# Altium schematic sheet Power over Ethernet.SchDoc
size A4; SheetNumber: 2; SheetTotal: 8
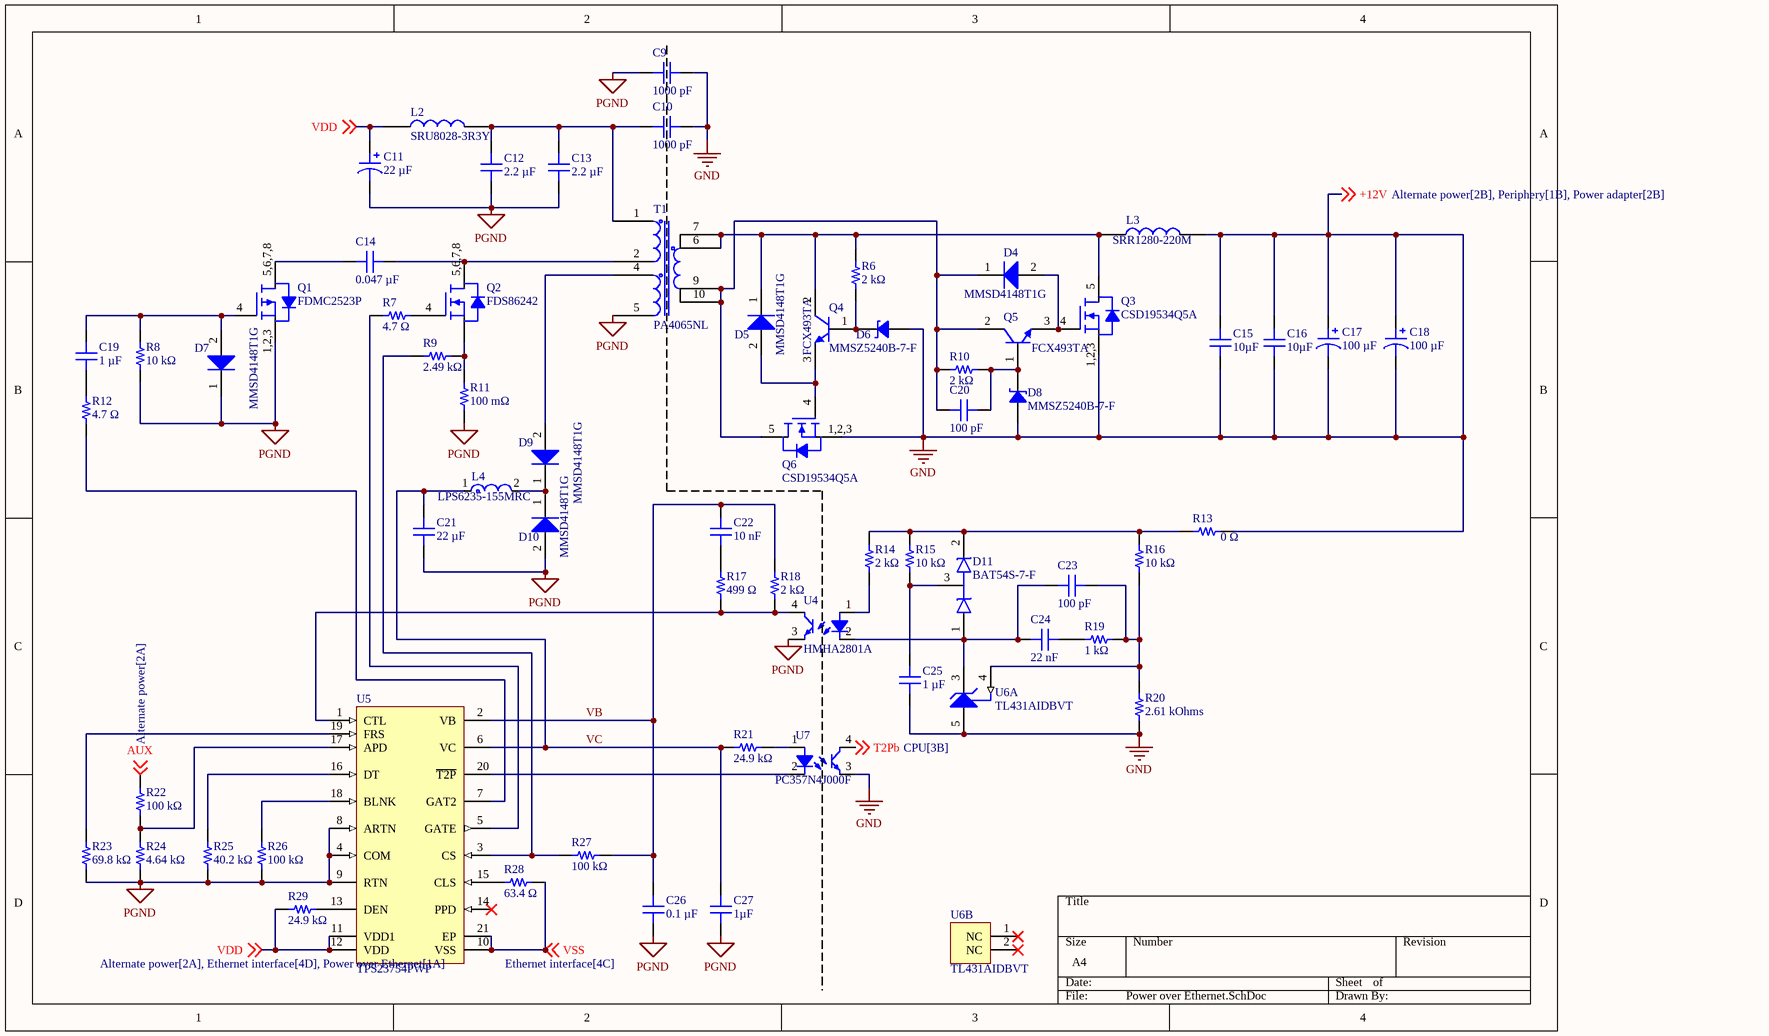
[diagram p0: Power over Ethernet.SchDoc]

## Parts
C9  1000 pF  [CAP 1210_3225 - 1MM]
C10  1000 pF  [CAP 1210_3225 - 1MM]
C11  22 µF  [CAP ALSMD 6.6MM H8.0MM]
C12  2.2 µF  [CAP 1210_3225 - 1MM]
C13  2.2 µF  [CAP 1210_3225 - 1MM]
C14  0.047 µF  [CAP 1206_3216 - 0.8MM]
C15  10µF  [CAP 1210_3225 - 2.8MM]
C16  10µF  [CAP 1210_3225 - 2.8MM]
C17  100 µF  [CAP ALSMD 8.3MM H10.5MM]
C18  100 µF  [CAP ALSMD POLY 8.3MM H9.0MM]
C19  1 µF  [CAP 0805_2012]
C20  100 pF  [CAP 0603_1608]
C21  22 µF  [CAP 1210_3225 - 1MM]
C22  Capacitance: 10 nF  [CAP 0603_1608]  (hidden comment: 10000 pF)
C23  100 pF  [CAP 0603_1608]
C24  Capacitance: 22 nF  [CAP 0603_1608]  (hidden comment: 0.022 µF)
C25  1 µF  [CAP 0805_2012]
C26  0.1 µF  [CAP 0603_1608]
C27  1µF  [CAP 0805_2012]
D4  MMSD4148T1G  [ONSC-SOD-123-2-425-04_V]
D5  MMSD4148T1G  [ONSC-SOD-123-2-425-04_V]
D6  MMSZ5240B-7-F  [SOD-123]
D7  MMSD4148T1G  [ONSC-SOD-123-2-425-04_V]
D8  MMSZ5240B-7-F  [SOD-123]
D9  MMSD4148T1G  [ONSC-SOD-123-2-425-04_V]
D10  MMSD4148T1G  [ONSC-SOD-123-2-425-04_V]
D11  BAT54S-7-F  [SOT96P240X115-3N]
L2  SRU8028-3R3Y  [SRU8028]
L3  SRR1280-220M  [SRR1280220M]
L4  LPS6235-155MRC  [FP-LPS6235-MFG]
Q1  FDMC2523P  [FDMC_2523P_ONS]
Q2  FDS86242  [SOIC127P600X175-8N]
Q3  CSD19534Q5A  [CSD19534Q5A]
Q4  FCX493TA  [FCX493TA_DIO]
Q5  FCX493TA  [FCX493TA_DIO]
Q6  CSD19534Q5A  [CSD19534Q5A]
R6  2 kΩ  [RES 1206_3216]
R7  4.7 Ω  [RES 0603_1608]
R8  10 kΩ  [RES 0603_1608]
R9  2.49 kΩ  [RES 0603_1608]
R10  2 kΩ  [RES 1206_3216]
R11  100 mΩ  [RES 1210_3225]
R12  4.7 Ω  [RES 0603_1608]
R13  0 Ω  [RES 0603_1608]
R14  2 kΩ  [RES 0603_1608]
R15  10 kΩ  [RES 0603_1608]
R16  10 kΩ  [RES 0603_1608]
R17  499 Ω  [RES 0603_1608]
R18  2 kΩ  [RES 0603_1608]
R19  1 kΩ  [RES 0603_1608]
R20  2.61 kOhms  [RES 0603_1608]
R21  24.9 kΩ  [RES 0603_1608]
R22  100 kΩ  [RES 0603_1608]
R23  69.8 kΩ  [RES 0603_1608]
R24  4.64 kΩ  [YAGEO RES 0603_1608]
R25  40.2 kΩ  [YAGEO RES 0603_1608]
R26  100 kΩ  [RES 0603_1608]
R27  100 kΩ  [RES 0603_1608]
R28  63.4 Ω  [KOA RES RK73 RN73 0603_1608]
R29  24.9 kΩ  [RES 0603_1608]
T1  PA4065NL  [PA4065NL]
U4  HMHA2801A  [SOIC127P680X239-4N]
U5  TPS23754PWP  [PWP0020D_M]
U6  TL431AIDBVT  [DBV0005A_N]  (parts A,B of 2)
U7  PC357N4J000F  [SOP254P675X300-4N]

## Nets
GND: C9.1 C10.1 C15.1 C15.2 C16.1 C16.2 C17.1 C17.2 C18.1 C18.2 C25.1 D6.1 D8.1 L3.2 Q3.1,2,3(S) Q6.1,2,3(S) R13.2 R20.1 U6.5(ANODE) U7.3 ; off-sheet +12V  [also labelled +12V]
PGND: C9.2 C11.2 C12.1 C13.1 C21.1 C26.1 C27.2 D7.1(K) D10.2(A) Q1.1,2,3(S) R8.1 R11.1 R23.1 R24.1 R25.1 R26.1 T1.5 U4.3 U5.4(COM) U5.8(ARTN) U5.9(RTN)
AUX: R22.2 ; off-sheet AUX
T2Pb: U7.4 ; off-sheet T2Pb
VB: C22.1 C26.2 R18.1 R27.2 U5.2(VB)
VC: C21.2 C27.1 L4.1 R21.1 U5.6(VC)
VDD: C11.1 L2.1 R29.1 U5.11(VDD1) U5.12(VDD) ; off-sheet VDD
VSS: R28.1 U5.10(VSS) U5.21(EP) ; off-sheet VSS
NetC10_2: C10.2 C12.2 C13.2 L2.2 T1.1
NetC14_1: C14.1 Q1.5,6,7,8(D)
NetC14_2: C14.2 Q2.5,6,7,8(D) T1.2
NetC19_1: C19.1 R12.2
NetC19_2: C19.2 D7.2(A) Q1.4(G) R8.2
NetC20_1: C20.1 D4.1(K) Q5.2(C) Q6.5(D) R10.2 T1.9 T1.10
NetC20_2: C20.2 D8.2 Q5.1(B) R10.1
NetC22_2: C22.2 R17.1
NetC23_1: C23.1 C24.1 D11.1(A) U4.2 U6.3(CATHODE)
NetC23_2: C23.2 R16.1 R19.2 R20.2 U6.4(REF)
NetC24_2: C24.2 R19.1
NetC25_2: C25.2 D11.3(A/K) R15.1
NetD4_2: D4.2(A) Q3.4(G) Q5.3(E)
NetD5_1: D5.1(K) L3.1 Q3.5(D) Q4.2(C) R6.2 T1.6 T1.7
NetD5_2: D5.2(A) Q4.3(E) Q6.4(G)
NetD6_2: D6.2 Q4.1(B) R6.1
NetD9_1: D9.1(K) D10.1(K) L4.2
NetD9_2: D9.2(A) T1.4
NetD11_2: D11.2(K) R13.1 R14.1 R15.2 R16.2
NetQ2_1,2,3: Q2.1,2,3(S) R9.2 R11.2
NetQ2_4: Q2.4(G) R7.2
NetR7_1: R7.1 U5.5(GATE)
NetR9_1: R9.1 R27.1 U5.3(CS)
NetR12_1: R12.1 U5.7(GAT2)
NetR14_2: R14.2 U4.1
NetR17_2: R17.2 R18.2 U4.4 U5.1(CTL)
NetR21_2: R21.2 U7.1
NetR22_1: R22.1 R24.2 U5.17(APD)
NetR23_2: R23.2 U5.19(FRS)
NetR25_2: R25.2 U5.16(DT)
NetR26_2: R26.2 U5.18(BLNK)
NetR28_2: R28.2 U5.15(CLS)
NetR29_2: R29.2 U5.13(DEN)
NetU5_20: U5.20(~{T2P}) U7.2

Not connected (* = marked no-connect by the designer): U5 14(PPD)*; U6 1(NC)* 2(NC)*

## Library data of the parts
C9 C10 = KGM32LCG3D102JU: CAP CER 1000PF 2KV C0G/NP0 1210; manufacturer: KYOCERA AVX; Temperature Coefficient: C0G, NP0; Tolerance: ±5%; Voltage - Rated: 2000V (2kV); Part Number: KGM32LCG3D102JU; Value: 1000 pF; Applications: General Purpose; Capacitance: 1000 pF; componentlink1description: Datasheet; componentlink1url: https://datasheets.kyocera-avx.com/HVKGM.pdf; componentlink2description: DigiKey Link; componentlink2url: https://www.digikey.com/en/products/detail/kyocera-avx/KGM32LCG3D102JU/11249117; Device Package: 1210 (3225 Metric); Features: High Voltage; lastupdated: 4.06.2024 19:20:42; Lifecycle Status: Active; Minimum Order: 1; Mounting Type: Surface Mount, MLCC; Operating Temperature: -55°C ~ 125°C; Package / Case: 1210 (3225 Metric); packaging: TapeAndReel; partid: 58470; price: 0.32; series: KGM - HV; Size / Dimension: 0.130" L x 0.098" W (3.30mm x 2.50mm); Supplier 1: DigiKey; Supplier Part Number 1: 478-KGM32LCG3D102JUCT-ND; Thickness (Max): 0.110" (2.80mm)
C11 = EEE-FK1J220XP: CAP ALUM 22UF 20% 63V SMD; manufacturer: Panasonic Electronic Components; Impedance: 1.2 Ohms; Lifetime @ Temp.: 2000 Hrs @ 105°C; Polarization: Polar; Ripple Current @ High Frequency: 120 mA @ 100 kHz; Ripple Current @ Low Frequency: 90 mA @ 120 Hz; Surface Mount Land Size: 0.260" L x 0.260" W (6.60mm x 6.60mm); Part Number: EEE-FK1J220XP; Applications: Automotive; Capacitance: 22 µF; componentlink2description: DigiKey Link; componentlink2url: https://www.digikey.com/en/products/detail/panasonic-electronic-components/EEE-FK1J220XP/765990; Device Package: Radial, Can - SMD; Height - Seated (Max): 0.315" (8.00mm); lastupdated: 3.06.2024 20:16:28; Lifecycle Status: Active; Minimum Order: 1; Mounting Type: Surface Mount; Operating Temperature: -55°C ~ 105°C; Package / Case: Radial, Can - SMD; packaging: TapeAndReel; partid: 27801; Part Status: Active; price: 0.14; Ratings: AEC-Q200; series: FK; Size / Dimension: 0.248" Dia (6.30mm); Tolerance: ±20%; value: 22 µF; Voltage - Rated: 63 V; Supplier 1: DigiKey; Supplier Part Number 1: PCE3821CT-ND
C12 C13 = CL32B225KCJSNNE: CAP CER 2.2UF 100V X7R 1210; manufacturer: Samsung Electro-Mechanics; Tolerance: ±10%; Part Number: CL32B225KCJSNNE; Value: 2.2 µF; Applications: General Purpose; Capacitance: 2.2 µF; componentlink1description: Datasheet; componentlink1url: http://www.samsungsem.com/kr/support/product-search/mlcc/CL32B225KCJSNNE .jsp; componentlink2description: DigiKey Link; componentlink2url: https://www.digikey.com/en/products/detail/samsung-electro-mechanics/CL32B225KCJSNNE/3889020; Device Package: 1210 (3225 Metric); Features: Soft Termination; lastupdated: 4.06.2024 19:20:59; Lifecycle Status: Active; Minimum Order: 1; Mounting Type: Surface Mount, MLCC; Operating Temperature: -55°C ~ 125°C; Package / Case: 1210 (3225 Metric); packaging: TapeAndReel; partid: 24106; Part Status: Active; price: 0.09; series: CL; Size / Dimension: 0.126" L x 0.098" W (3.20mm x 2.50mm); Supplier 1: DigiKey; Supplier Part Number 1: 1276-3362-1-ND; Temperature Coefficient: X7R; Thickness (Max): 0.106" (2.70mm); Voltage - Rated: 100V
C14 = C3216X7R2E473K160AA: CAP CER 0.047UF 250V X7R 1206; manufacturer: TDK Corporation; Tolerance: ±10%; Part Number: C3216X7R2E473K160AA; Capacitance: 0.047 µF; Applications: General Purpose; componentlink1description: Datasheet; componentlink1url: https://product.tdk.com/info/en/catalog/datasheets/mlcc_commercial_midvoltage_en.pdf?ref_disty=digikey; componentlink2description: DigiKey Link; componentlink2url: https://www.digikey.com/en/products/detail/tdk-corporation/C3216X7R2E473K160AA/789680; Device Package: 1206 (3216 Metric); lastupdated: 4.06.2024 19:10:39; Lifecycle Status: Active; Minimum Order: 1; Mounting Type: Surface Mount, MLCC; Operating Temperature: -55°C ~ 125°C; Package / Case: 1206 (3216 Metric); packaging: TapeAndReel; partid: 20477; Part Status: Active; price: 0.05; series: C; Size / Dimension: 0.126" L x 0.063" W (3.20mm x 1.60mm); Supplier 1: DigiKey; Supplier Part Number 1: 445-2286-1-ND; Temperature Coefficient: X7R; Thickness (Max): 0.071" (1.80mm); value: 0.047 µF; Voltage - Rated: 250V
C15 C16 = 12103C106K4T2A: CAP CER 10UF 25V X7R 1210; manufacturer: AVX Corporation; Tolerance: ±10%; Part Number: 12103C106K4T2A; Value: 10µF; Applications: Automotive; Capacitance: 10µF; componentlink1description: Datasheet; componentlink1url: http://datasheets.avx.com/AutoMLCC.pdf; componentlink2description: DigiKey Link; componentlink2url: http://digikey.com/product-detail/en/avx-corporation/12103C106K4T2A/478-6128-1-ND/2295047; Device Package: 1210 (3225 Metric); lastupdated: 2.09.2020 01:10:50; Lifecycle Status: Active; Minimum Order: 1; Mounting Type: Surface Mount, MLCC; Operating Temperature: -55°C ~ 125°C; Package / Case: 1210 (3225 Metric); packaging: TapeAndReel; partid: 24004; Part Status: Active; price: 0.31; Ratings: AEC-Q200; series: -; Size / Dimension: 0.126" L x 0.098" W (3.20mm x 2.50mm); Temperature Coefficient: X7R; Thickness (Max): 0.110" (2.79mm); Voltage - Rated: 25V; Supplier 1: DigiKey; Supplier Part Number 1: 478-KAM32LR71E106KUCT-ND
C17 = EEE-TC1E101P: CAP ALUM 100UF 20% 25V SMD; manufacturer: Panasonic Electronic Components; ESR (Equivalent Series Resistance): 200mOhm @ 100kHz; Lifetime @ Temp.: 3000 Hrs @ 125°C; Polarization: Polar; Ripple Current @ High Frequency: 410 mA @ 100 kHz; Ripple Current @ Low Frequency: 266.5 mA @ 120 Hz; Surface Mount Land Size: 0.327" L x 0.327" W (8.30mm x 8.30mm); Part Number: EEE-TC1E101P; Applications: Automotive, High Temperature Reflow; Capacitance: 100 µF; componentlink1description: Datasheet; componentlink1url: https://na.industrial.panasonic.com/file-download/3053; componentlink2description: DigiKey Link; componentlink2url: https://www.digikey.com/en/products/detail/panasonic-electronic-components/EEE-TC1E101P/6048991; Device Package: Radial, Can - SMD; Height - Seated (Max): 0.413" (10.50mm); lastupdated: 3.06.2024 20:15:48; Lifecycle Status: Active; Minimum Order: 1; Mounting Type: Surface Mount; Operating Temperature: -40°C ~ 125°C; Package / Case: Radial, Can - SMD; packaging: TapeAndReel; partid: 7495; Part Status: Active; price: 0.29; Ratings: AEC-Q200; series: TC; Size / Dimension: 0.315" Dia (8.00mm); Supplier 1: DigiKey; Supplier Part Number 1: PCE5130CT-ND; Tolerance: ±20%; value: 100 µF; Voltage - Rated: 25 V
C18 = RHS1E101MCN1GS: CAP ALUM POLY 100UF 20% 25V SMD; manufacturer: Nichicon; ESR (Equivalent Series Resistance): 18mOhm; Lifetime @ Temp.: 2000 Hrs @ 105°C; Ripple Current @ High Frequency: 4 A @ 100 kHz; Ripple Current @ Low Frequency: 400 mA @ 120 Hz; Surface Mount Land Size: 0.327" L x 0.327" W (8.30mm x 8.30mm); Type: Polymer; Part Number: RHS1E101MCN1GS; Applications: General Purpose; Capacitance: 100 µF; componentlink1description: Datasheet; componentlink1url: http://nichicon-us.com/english/products/pdfs/e-rhs_rha.pdf; componentlink2description: DigiKey Link; componentlink2url: https://www.digikey.com/en/products/detail/nichicon/RHS1E101MCN1GS/4991412; Device Package: Radial, Can - SMD; Height - Seated (Max): 0.354" (9.00mm); lastupdated: 3.06.2024 20:16:48; Lifecycle Status: Active; Minimum Order: 1; Mounting Type: Surface Mount; Operating Temperature: -55°C ~ 105°C; Package / Case: Radial, Can - SMD; packaging: TapeAndReel; partid: 5072; Part Status: Active; price: 0.89; series: FPCAP, RHS; Size / Dimension: 0.315" Dia (8.00mm); Supplier 1: DigiKey; Supplier Part Number 1: 493-14783-1-ND; Tolerance: ±20%; value: 100 µF; Voltage - Rated: 25 V
C19 C25 = C2012X7R1E105K125AB: CAP CER 1UF 25V X7R 0805; manufacturer: TDK Corporation; Tolerance: ±10%; Part Number: C2012X7R1E105K125AB; Capacitance: 1 µF; Applications: General Purpose; componentlink1description: Datasheet; componentlink1url: https://product.tdk.com/info/en/catalog/datasheets/mlcc_commercial_general_en.pdf?ref_disty=digikey; componentlink2description: DigiKey Link; componentlink2url: https://www.digikey.com/en/products/detail/tdk-corporation/C2012X7R1E105K125AB/513887; Device Package: 0805 (2012 Metric); Features: Low ESL; lastupdated: 9.02.2024 20:15:16; Lifecycle Status: Active; Minimum Order: 1; Mounting Type: Surface Mount, MLCC; Operating Temperature: -55°C ~ 125°C; Package / Case: 0805 (2012 Metric); packaging: TapeAndReel; partid: 33961; Part Status: Active; price: 0.03; series: C; Size / Dimension: 0.079" L x 0.049" W (2.00mm x 1.25mm); Supplier 1: DigiKey; Supplier Part Number 1: 445-1354-1-ND; Temperature Coefficient: X7R; Thickness (Max): 0.057" (1.45mm); value: 1 µF; Voltage - Rated: 25V
C20 C23 = C1608C0G1H101J080AE: CAP CER 100PF 50V NP0 0603; manufacturer: TDK Corporation; Temperature Coefficient: C0G, NP0; Tolerance: ±5%; Part Number: C1608C0G1H101J080AE; Capacitance: 100 pF; Applications: Boardflex Sensitive; componentlink1description: Datasheet; componentlink1url: https://product.tdk.com/info/en/catalog/datasheets/mlcc_commercial_soft_en.pdf?ref_disty=digikey; componentlink2description: DigiKey Link; componentlink2url: https://www.digikey.com/en/products/detail/tdk-corporation/C1608C0G1H101J080AE/5809176; Device Package: 0603 (1608 Metric); Features: Soft Termination; lastupdated: 9.02.2024 20:10:12; Lifecycle Status: Active; Minimum Order: 1; Mounting Type: Surface Mount, MLCC; Operating Temperature: -55°C ~ 125°C; Package / Case: 0603 (1608 Metric); packaging: TapeAndReel; partid: 15324; Part Status: Active; price: 0.01; series: C; Size / Dimension: 0.063" L x 0.031" W (1.60mm x 0.80mm); Supplier 1: DigiKey; Supplier Part Number 1: 445-173611-1-ND; Thickness (Max): 0.035" (0.90mm); value: 100 pF; Voltage - Rated: 50V
C21 = CL32B226KAJNNWE: CAP CER 22UF 25V X7R 1210; manufacturer: Samsung Electro-Mechanics; Tolerance: ±10%; Part Number: CL32B226KAJNNWE; Value: 22 µF; Applications: General Purpose; Capacitance: 22 µF; componentlink1description: Datasheet; componentlink1url: http://www.samsungsem.com/kr/support/product-search/mlcc/CL32B226KAJNNWE.jsp; componentlink2description: DigiKey Link; componentlink2url: https://www.digikey.com/en/products/detail/samsung-electro-mechanics/CL32B226KAJNNWE/3889051; Device Package: 1210 (3225 Metric); lastupdated: 4.06.2024 19:21:03; Lifecycle Status: Active; Minimum Order: 1; Mounting Type: Surface Mount, MLCC; Operating Temperature: -55°C ~ 125°C; Package / Case: 1210 (3225 Metric); packaging: TapeAndReel; partid: 23847; Part Status: Active; price: 0.32; series: CL; Size / Dimension: 0.126" L x 0.098" W (3.20mm x 2.50mm); Supplier 1: DigiKey; Supplier Part Number 1: 1276-3393-1-ND; Temperature Coefficient: X7R; Thickness (Max): 0.106" (2.70mm); Voltage - Rated: 25V
C22 = C1608X7R1H103K080AE: CAP CER 10000PF 50V X7R 0603; manufacturer: TDK Corporation; Tolerance: ±10%; Part Number: C1608X7R1H103K080AE; Applications: Boardflex Sensitive; componentlink1description: Datasheet; componentlink1url: https://product.tdk.com/info/en/catalog/datasheets/mlcc_commercial_soft_en.pdf?ref_disty=digikey; componentlink2description: DigiKey Link; componentlink2url: https://www.digikey.com/en/products/detail/tdk-corporation/C1608X7R1H103K080AE/4490562; Device Package: 0603 (1608 Metric); Features: Soft Termination; lastupdated: 9.02.2024 20:10:18; Lifecycle Status: Active; Minimum Order: 1; Mounting Type: Surface Mount, MLCC; Operating Temperature: -55°C ~ 125°C; Package / Case: 0603 (1608 Metric); packaging: TapeAndReel; partid: 11552; Part Status: Active; price: 0.02; series: C; Size / Dimension: 0.063" L x 0.031" W (1.60mm x 0.80mm); Supplier 1: DigiKey; Supplier Part Number 1: 445-15925-1-ND; Temperature Coefficient: X7R; Thickness (Max): 0.037" (0.95mm); value: 10000 pF; Voltage - Rated: 50V
C24 = C1608X7R1H223K080AE: CAP CER 0.022UF 50V X7R 0603; manufacturer: TDK Corporation; Tolerance: ±10%; Part Number: C1608X7R1H223K080AE; Applications: Boardflex Sensitive; componentlink1description: Datasheet; componentlink1url: https://product.tdk.com/info/en/catalog/datasheets/mlcc_commercial_soft_en.pdf?ref_disty=digikey; componentlink2description: DigiKey Link; componentlink2url: https://www.digikey.com/en/products/detail/tdk-corporation/C1608X7R1H223K080AE/5809178; Device Package: 0603 (1608 Metric); Features: Soft Termination; lastupdated: 9.02.2024 20:10:18; Lifecycle Status: Active; Minimum Order: 1; Mounting Type: Surface Mount, MLCC; Operating Temperature: -55°C ~ 125°C; Package / Case: 0603 (1608 Metric); packaging: TapeAndReel; partid: 11617; Part Status: Active; price: 0.02; series: C; Size / Dimension: 0.063" L x 0.031" W (1.60mm x 0.80mm); Supplier 1: DigiKey; Supplier Part Number 1: 445-173613-1-ND; Temperature Coefficient: X7R; Thickness (Max): 0.035" (0.90mm); value: 0.022 µF; Voltage - Rated: 50V
C26 = C1608X7R1H104K080AE: CAP CER 0.1UF 50V X7R 0603; manufacturer: TDK Corporation; Tolerance: ±10%; Part Number: C1608X7R1H104K080AE; Capacitance: 0.1 µF; Applications: Boardflex Sensitive; componentlink1description: Datasheet; componentlink1url: https://product.tdk.com/info/en/catalog/datasheets/mlcc_commercial_soft_en.pdf?ref_disty=digikey; componentlink2description: DigiKey Link; componentlink2url: https://www.digikey.com/en/products/detail/tdk-corporation/C1608X7R1H104K080AE/4490564; Device Package: 0603 (1608 Metric); Features: Soft Termination; lastupdated: 9.02.2024 20:10:17; Lifecycle Status: Active; Minimum Order: 1; Mounting Type: Surface Mount, MLCC; Operating Temperature: -55°C ~ 125°C; Package / Case: 0603 (1608 Metric); packaging: TapeAndReel; partid: 12789; Part Status: Active; price: 0.02; series: C; Size / Dimension: 0.063" L x 0.031" W (1.60mm x 0.80mm); Supplier 1: DigiKey; Supplier Part Number 1: 445-15927-6-ND; Temperature Coefficient: X7R; Thickness (Max): 0.037" (0.95mm); value: 0.1 µF; Voltage - Rated: 50V
C27 = 08053C105MAT4A: CAP CER 1UF 25V X7R 0805; manufacturer: AVX Corporation; Tolerance: ±20%; Part Number: 08053C105MAT4A; Capacitance: 1µF; Applications: General Purpose; componentlink1description: Datasheet; componentlink1url: http://datasheets.avx.com/X7RDielectric.pdf; componentlink2description: DigiKey Link; componentlink2url: http://digikey.com/product-detail/en/avx-corporation/08053C105MAT4A/478-11517-1-ND/8107718; Device Package: 0805 (2012 Metric); lastupdated: 2.09.2020 01:04:40; Lifecycle Status: Active; Minimum Order: 1; Mounting Type: Surface Mount, MLCC; Operating Temperature: -55°C ~ 125°C; Package / Case: 0805 (2012 Metric); packaging: TapeAndReel; partid: 3658; Part Status: Active; price: 0.04; series: -; Size / Dimension: 0.079" L x 0.049" W (2.01mm x 1.25mm); Temperature Coefficient: X7R; Thickness (Max): 0.055" (1.40mm); value: 1µF; Voltage - Rated: 25V; Supplier 1: DigiKey; Supplier Part Number 1: 478-KGM21AR71E105MLCT-ND
D4 D5 D7 D9 D10 = CMP-0895-00001-2: Switching Diode, 2-Pin SOD-123, Pb-Free, Tape and Reel; Manufacturer: On Semiconductor; trr Max (ns): 4; IF Max (A): 0.2; Configuration: Single; Mounting Technology: Surface Mount; ComponentLink2URL: http://www.onsemi.com/pub_link/Collateral/MMSD4148T1-D.PDF; ComponentLink1Description: Manufacturer URL; ComponentLink1URL: http://www.onsemi.com/; PartNumber: MMSD4148T1G; ComponentLink2Description: Datasheet; PackageDescription: 2-Pin SOD, Body 1.6 x 2.69 mm; Packing: Tape and Reel; DatasheetVersion: Rev. 11; PackageReference: SOD-123-2-425-04; ComponentLink3Description: Package Specification; ComponentLink3URL: http://www.onsemi.com/pub_link/Collateral/425-04.PDF; PackageVersion: Rev. G, 10/2009; RoHS: TRUE
D6 D8 = MMSZ5240B-7-F: DIODE ZENER 10V 500MW SOD123; Manufacturer: Diodes Incorporated; Current - Reverse Leakage @ Vr: 3 µA @ 8 V; Impedance (Max) (Zzt): 17 Ohms; Tolerance: ±5%; Voltage - Forward (Vf) (Max) @ If: 900 mV @ 10 mA; Part Number: MMSZ5240B-7-F; ComponentLink1Description: Datasheet; ComponentLink1URL: https://www.diodes.com/assets/Datasheets/ds18010.pdf; ComponentLink2Description: DigiKey Link; ComponentLink2URL: https://www.digikey.com/en/products/detail/diodes-incorporated/MMSZ5240B-7-F/814369; LastUpdated: 3.06.2024 19:55:44; Lifecycle Status: Active; Minimum Order: 1; Mounting Type: Surface Mount; Operating Temperature: -65°C ~ 150°C; Package / Case: SOD-123; Packaging: TapeAndReel; PartId: 2232; Part Status: Active; Power - Max: 500 mW; Price: 0.02; Series: -; Supplier 1: DigiKey; Supplier Part Number 1: MMSZ5240B-FDICT-ND; Supplier Device Package: SOD-123; Voltage - Zener (Nom) (Vz): 10 V
D11 = BAT54S-7-F: Schottky Diode 2xSeries 200mA 30V SOT23 Diodes Inc BAT54S-7-F, Dual SMT Schottky Switching Diode, Series, 30V 200mA, 5ns, 3-Pin SOT-23; Manufacturer_Name: Diodes Incorporated; Geometry.Height: 1.15mm; Manufacturer_Part_Number: BAT54S-7-F; Mouser Part Number: 621-BAT54S-F; Mouser Price/Stock: https://www.mouser.co.uk/ProductDetail/Diodes-Incorporated/BAT54S-7-F?qs=SrifhsLOLf4kNGw4QqCzrA%3D%3D; Arrow Part Number: BAT54S-7-F; Arrow Price/Stock: https://www.arrow.com/en/products/bat54s-7-f/diodes-incorporated?utm_currency=USD&region=nac; Datasheet Link: https://www.diodes.com//assets/Datasheets/BAT54_A_C_S.pdf; Supplier 1: DigiKey; Supplier Part Number 1: BAT54S-FDICT-ND
L2 = SRU8028-3R3Y: Fixed Inductors 3.3uH 30% SMD 8028; Manufacturer_Name: Bourns; Geometry.Height: 3.1mm; Manufacturer_Part_Number: SRU8028-3R3Y; Mouser Part Number: 652-SRU8028-3R3Y; Mouser Price/Stock: https://www.mouser.co.uk/ProductDetail/Bourns/SRU8028-6R8Y?qs=3fQS%252B%2FKBkgz4upOBBdUIOQ%3D%3D; Arrow Part Number: SRU8028-3R3Y; Arrow Price/Stock: https://www.arrow.com/en/products/sru8028-6r8y/bourns?region=nac; Datasheet Link: http://www.bourns.com/docs/Product-Datasheets/SRU8028.pdf; Supplier 1: DigiKey; Supplier Part Number 1: SRU8028-3R3YCT-ND; Supplier 2: Mouser; Supplier Part Number 2: 652-SRU8028-3R3Y; Supplier 3: Arrow Electronics; Supplier Part Number 3: SRU8028-3R3Y
L3 = SRR1280-220M: Power inductor SMD shielded 22uH Bourns SRR1280 Series Shielded Wire-wound SMD Inductor with a Ferrite Core, 22 uH +/-20% 4.3A Idc Q:20; Geometry.Height: 8mm; Manufacturer_Name: Bourns; Manufacturer_Part_Number: SRR1280-220M; Mouser Part Number: 652-SRR1280-220M; Mouser Price/Stock: https://www.mouser.co.uk/ProductDetail/Bourns/SRR1280-220M?qs=brMhP%2FMjUfflRvtsE3Ok8w%3D%3D; Arrow Part Number: SRR1280-220M; Arrow Price/Stock: https://www.arrow.com/en/products/srr1280-220m/bourns?region=europe; Datasheet Link: https://www.bourns.com/docs/Product-Datasheets/SRR1280.pdf; Supplier 1: DigiKey; Supplier Part Number 1: SRR1280-220MCT-ND; Supplier 2: Mouser; Supplier Part Number 2: 652-SRR1280-220M; Supplier 3: Arrow Electronics; Supplier Part Number 3: SRR1280-220M
L4 = CMP-01768-30061421-1: LPS6235-155MRC Power inductor, shielded, 20% tol, SMT, RoHS, lead-free, halogen-free; Inductance: 1.5mH; Series Resistance: 4.6Ω; Saturation Current: 120mA; Test Frequency: 100kHz; RMS Current (Irms): 260mA; Core Material: Ferrite; Self Resonant Frequency: 1.9MHz; Tolerance: 20%; Ambient Temperature Range High: 85°C; RoHS: Non-Compliant; Height: 3.5mm; NexarPartId: 30061421; Lifecycle Status: Production; Composition: Wirewound
Q1 = FDMC2523P: P-Channel 150 V 3A (Tc) 42W (Tc) Surface Mount 8-MLP (3.3x3.3); Manufacturer_Name: onsemi; Copyright: Copyright (C) 2025 Ultra Librarian. All rights reserved.; Manufacturer_Part_Number: FDMC2523P; RefDes: RefDes; Type: Type; Supplier 1: DigiKey; Supplier Part Number 1: FDMC2523PCT-ND
Q2 = FDS86242: 100% UIL Tested; Max rDS(on) = 67 m at VGS = 10 V, ID = 4.1 A; High performance trench technology for extremely low rDS(on); Max rDS(on) = 98m at VGS = 6 V, ID = 3.3 A; RoHS Compliant; High power and current handling capability in a widely usedsurface mount package; Manufacturer_Name: onsemi; Geometry.Height: 1.75mm; Manufacturer_Part_Number: FDS86242; Mouser Part Number: 512-FDS86242; Mouser Price/Stock: https://www.mouser.co.uk/ProductDetail/ON-Semiconductor-Fairchild/FDS86242?qs=WZYOKEqGBpJo60pi1Jf2hA%3D%3D; Arrow Part Number: FDS86242; Arrow Price/Stock: https://www.arrow.com/en/products/fds86242/on-semiconductor; Datasheet Link: https://www.onsemi.com/pub/Collateral/FDS86242-D.PDF; Supplier 1: DigiKey; Supplier Part Number 1: FDS86242CT-ND
Q3 Q6 = CSD19534Q5A: 100V, N ch NexFET MOSFET, single SON5x6, 15.1mOhm 8-VSONP -55 to 150; MF: Texas Instruments; Mouser-Purchase-URL: https://snapeda.com/shop?store=Mouser&id=485742; Package: VSONP-8 Texas Instruments; Texas_Instruments-Purchase-URL: https://snapeda.com/shop?store=Texas+Instruments&id=485742; Value: *; Price: None; DigiKey-Purchase-URL: https://snapeda.com/shop?store=DigiKey&id=485742; MP: CSD19534Q5A; SnapEDA_Link: https://www.snapeda.com/parts/CSD19534Q5A/Texas%20Instruments/view-part/485742/?ref=snap; Availability: Good; Supplier 1: Arrow Electronics; Supplier Part Number 1: CSD19534Q5A
Q4 Q5 = FCX493TA: Description; Manufacturer_Name: Diodes Inc; Copyright: Copyright (C) 2025 Ultra Librarian. All rights reserved.; Manufacturer_Part_Number: FCX493TA; RefDes: RefDes; Type: Type; Supplier 1: DigiKey; Supplier Part Number 1: FCX493CT-ND
R6 R10 = CRCW12062K00JNEA: RES SMD 2K OHM 5% 1/4W 1206; Manufacturer: Vishay Dale; Power (Watts): 0.25W, 1/4W; Temperature Coefficient: ±200ppm/°C; Part Number: CRCW12062K00JNEA; ComponentLink1Description: Datasheet; ComponentLink1URL: http://www.vishay.com/docs/20035/dcrcwe3.pdf; ComponentLink2Description: DigiKey Link; ComponentLink2URL: https://www.digikey.com/en/products/detail/vishay-dale/CRCW12062K00JNEA/1176212; Composition: Thick Film; Device Package: 1206 (3216 Metric); Features: Automotive AEC-Q200; Height - Seated (Max): 0.024" (0.60mm); LastUpdated: 9.02.2024 20:54:08; Lifecycle Status: Active; Minimum Order: 1; Number of Terminations: 2; Operating Temperature: -55°C ~ 155°C; Package / Case: 1206 (3216 Metric); Packaging: TapeAndReel; PartId: 36387; Part Status: Active; Price: 0.01; Ratings: AEC-Q200; Resistance: 2 kΩ; Series: CRCW; Size / Dimension: 0.126" L x 0.063" W (3.20mm x 1.60mm); Supplier 1: DigiKey; Supplier Part Number 1: 541-2.0KECT-ND; Supplier Device Package: 1206; Tolerance: ±5%; Value: 2 kΩ
R7 R12 = CRCW06034R70JNEA: RES SMD 4.7 OHM 5% 1/10W 0603; Manufacturer: Vishay Dale; Power (Watts): 0.1W, 1/10W; Resistance: 4.7 Ohms; Temperature Coefficient: ±200ppm/°C; Part Number: CRCW06034R70JNEA; Value: 4.7 Ω; ComponentLink1Description: Datasheet; ComponentLink1URL: http://www.vishay.com/docs/20035/dcrcwe3.pdf; ComponentLink2Description: DigiKey Link; ComponentLink2URL: https://www.digikey.com/en/products/detail/vishay-dale/CRCW06034R70JNEA/1174173; Composition: Thick Film; Device Package: 0603 (1608 Metric); Features: Automotive AEC-Q200; Height - Seated (Max): 0.020" (0.50mm); LastUpdated: 9.02.2024 20:42:33; Lifecycle Status: Active; Minimum Order: 1; Number of Terminations: 2; Operating Temperature: -55°C ~ 155°C; Package / Case: 0603 (1608 Metric); Packaging: TapeAndReel; PartId: 21221; Part Status: Active; Price: 0.01; Ratings: AEC-Q200; Series: CRCW; Size / Dimension: 0.063" L x 0.033" W (1.60mm x 0.85mm); Supplier 1: DigiKey; Supplier Part Number 1: 541-4.7GCT-ND; Supplier Device Package: 0603; Tolerance: ±5%
R8 R15 R16 = CRCW060310K0FKEA: RES SMD 10K OHM 1% 1/10W 0603; Manufacturer: Vishay Dale; Power (Watts): 0.1W, 1/10W; Resistance: 10 kOhms; Temperature Coefficient: ±100ppm/°C; Part Number: CRCW060310K0FKEA; Value: 10 kΩ; ComponentLink1Description: Datasheet; ComponentLink1URL: http://www.vishay.com/docs/20035/dcrcwe3.pdf; ComponentLink2Description: DigiKey Link; ComponentLink2URL: https://www.digikey.com/en/products/detail/vishay-dale/CRCW060310K0FKEA/1174782; Composition: Thick Film; Device Package: 0603 (1608 Metric); Features: Automotive AEC-Q200; Height - Seated (Max): 0.020" (0.50mm); LastUpdated: 9.02.2024 20:42:10; Lifecycle Status: Active; Minimum Order: 1; Number of Terminations: 2; Operating Temperature: -55°C ~ 155°C; Package / Case: 0603 (1608 Metric); Packaging: CutTape; PartId: 24636; Part Status: Active; Price: 0.01; Ratings: AEC-Q200; Series: CRCW; Size / Dimension: 0.061" L x 0.033" W (1.55mm x 0.85mm); Supplier 1: DigiKey; Supplier Part Number 1: 541-10.0KHCT-ND; Supplier Device Package: 0603; Tolerance: ±1%
R9 = CRCW06032K49FKEA: RES SMD 2.49K OHM 1% 1/10W 0603; Manufacturer: Vishay Dale; Power (Watts): 0.1W, 1/10W; Resistance: 2.49 kOhms; Temperature Coefficient: ±100ppm/°C; Part Number: CRCW06032K49FKEA; Value: 2.49 kΩ; ComponentLink1Description: Datasheet; ComponentLink1URL: http://www.vishay.com/docs/20035/dcrcwe3.pdf; ComponentLink2Description: DigiKey Link; ComponentLink2URL: https://www.digikey.com/en/products/detail/vishay-dale/CRCW06032K49FKEA/1174711; Composition: Thick Film; Device Package: 0603 (1608 Metric); Features: Automotive AEC-Q200; Height - Seated (Max): 0.020" (0.50mm); LastUpdated: 9.02.2024 20:42:28; Lifecycle Status: Active; Minimum Order: 1; Number of Terminations: 2; Operating Temperature: -55°C ~ 155°C; Package / Case: 0603 (1608 Metric); Packaging: TapeAndReel; PartId: 22463; Part Status: Active; Price: 0.01; Ratings: AEC-Q200; Series: CRCW; Size / Dimension: 0.061" L x 0.033" W (1.55mm x 0.85mm); Supplier 1: DigiKey; Supplier Part Number 1: 541-2.49KHCT-ND; Supplier Device Package: 0603; Tolerance: ±1%
R11 = RL1210JR-070R1L: RES 0.1 OHM 5% 1/2W 1210; Manufacturer: Yageo; Power (Watts): 0.5W, 1/2W; Temperature Coefficient: ±600ppm/°C; Part Number: RL1210JR-070R1L; ComponentLink1Description: Datasheet; ComponentLink1URL: http://www.yageo.com/documents/recent/PYu-RL_Group_521_RoHS_L_2.pdf; ComponentLink2Description: DigiKey Link; ComponentLink2URL: https://www.digikey.com/en/products/detail/yageo/RL1210JR-070R1L/3886421; Composition: Thick Film; Device Package: 1210 (3225 Metric); Features: Automotive AEC-Q200, Current Sense, Moisture Resistant; Height - Seated (Max): 0.026" (0.65mm); LastUpdated: 3.06.2024 20:19:08; Lifecycle Status: Active; Minimum Order: 1; Number of Terminations: 2; Operating Temperature: -55°C ~ 155°C; Package / Case: 1210 (3225 Metric); Packaging: TapeAndReel; Part Status: Active; Price: 0.06; Ratings: AEC-Q200; Resistance: 100 mΩ; Series: RL; Size / Dimension: 0.122" L x 0.102" W (3.10mm x 2.60mm); Supplier 1: DigiKey; Supplier Part Number 1: YAG5712CT-ND; Supplier Device Package: 1210; Tolerance: ±5%; Value: 100 mΩ
R13 = ERJ-3GEY0R00V: RES SMD 0 OHM JUMPER 1/10W 0603; Manufacturer: Panasonic Electronic Components; Power (Watts): 0.1W, 1/10W; Part Number: ERJ-3GEY0R00V; Value: 0 Ω; ComponentLink1Description: Datasheet; ComponentLink1URL: http://industrial.panasonic.com/www-cgi/jvcr13pz.cgi?E+PZ+3+AOA0001+ERJ3GEY0R00V+7+WW; ComponentLink2Description: DigiKey Link; ComponentLink2URL: https://www.digikey.com/en/products/detail/panasonic-electronic-components/ERJ-3GEY0R00V/135656; Composition: Thick Film; Device Package: 0603 (1608 Metric); Features: Automotive AEC-Q200; Height - Seated (Max): 0.022" (0.55mm); LastUpdated: 9.02.2024 20:42:26; Lifecycle Status: Active; Minimum Order: 1; Number of Terminations: 2; Operating Temperature: -55°C ~ 155°C; Package / Case: 0603 (1608 Metric); Packaging: CutTape; PartId: 22603; Part Status: Active; Price: 0.01; Ratings: AEC-Q200; Resistance: 0 Ω; Series: ERJ-3G; Size / Dimension: 0.063" L x 0.031" W (1.60mm x 0.80mm); Supplier 1: DigiKey; Supplier Part Number 1: P0.0GCT-ND; Supplier Device Package: 0603; Tolerance: Jumper
R14 R18 = CRCW06032K00FKEA: RES SMD 2K OHM 1% 1/10W 0603; Manufacturer: Vishay Dale; Power (Watts): 0.1W, 1/10W; Temperature Coefficient: ±100ppm/°C; Part Number: CRCW06032K00FKEA; Value: 2 kΩ; ComponentLink1Description: Datasheet; ComponentLink1URL: http://www.vishay.com/docs/20035/dcrcwe3.pdf; ComponentLink2Description: DigiKey Link; ComponentLink2URL: https://www.digikey.com/en/products/detail/vishay-dale/CRCW06032K00FKEA/1174700; Composition: Thick Film; Device Package: 0603 (1608 Metric); Features: Automotive AEC-Q200; Height - Seated (Max): 0.020" (0.50mm); LastUpdated: 9.02.2024 20:43:05; Lifecycle Status: Active; Minimum Order: 1; Number of Terminations: 2; Operating Temperature: -55°C ~ 155°C; Package / Case: 0603 (1608 Metric); Packaging: CutTape; PartId: 12693; Part Status: Active; Price: 0.01; Ratings: AEC-Q200; Resistance: 2 kΩ; Series: CRCW; Size / Dimension: 0.061" L x 0.033" W (1.55mm x 0.85mm); Supplier 1: DigiKey; Supplier Part Number 1: 541-2.00KHCT-ND; Supplier Device Package: 0603; Tolerance: ±1%
R17 = CRCW0603499RFKEA: RES SMD 499 OHM 1% 1/10W 0603; Manufacturer: Vishay Dale; Power (Watts): 0.1W, 1/10W; Temperature Coefficient: ±100ppm/°C; Part Number: CRCW0603499RFKEA; Value: 499 Ω; ComponentLink1Description: Datasheet; ComponentLink1URL: http://www.vishay.com/docs/20035/dcrcwe3.pdf; ComponentLink2Description: DigiKey Link; ComponentLink2URL: https://www.digikey.com/en/products/detail/vishay-dale/CRCW0603499RFKEA/1174633; Composition: Thick Film; Device Package: 0603 (1608 Metric); Features: Automotive AEC-Q200; Height - Seated (Max): 0.020" (0.50mm); LastUpdated: 9.02.2024 20:43:05; Lifecycle Status: Active; Minimum Order: 1; Number of Terminations: 2; Operating Temperature: -55°C ~ 155°C; Package / Case: 0603 (1608 Metric); Packaging: TapeAndReel; PartId: 12624; Part Status: Active; Price: 0.01; Ratings: AEC-Q200; Resistance: 499 Ω; Series: CRCW; Size / Dimension: 0.061" L x 0.033" W (1.55mm x 0.85mm); Supplier 1: DigiKey; Supplier Part Number 1: 541-499HCT-ND; Supplier Device Package: 0603; Tolerance: ±1%
R19 = CRCW06031K00FKEA: RES SMD 1K OHM 1% 1/10W 0603; Manufacturer: Vishay Dale; Power (Watts): 0.1W, 1/10W; Resistance: 1 kOhms; Temperature Coefficient: ±100ppm/°C; Part Number: CRCW06031K00FKEA; Value: 1 kΩ; ComponentLink1Description: Datasheet; ComponentLink1URL: http://www.vishay.com/docs/20035/dcrcwe3.pdf; ComponentLink2Description: DigiKey Link; ComponentLink2URL: https://www.digikey.com/en/products/detail/vishay-dale/CRCW06031K00FKEA/1174668; Composition: Thick Film; Device Package: 0603 (1608 Metric); Features: Automotive AEC-Q200; Height - Seated (Max): 0.020" (0.50mm); LastUpdated: 9.02.2024 20:42:10; Lifecycle Status: Active; Minimum Order: 1; Number of Terminations: 2; Operating Temperature: -55°C ~ 155°C; Package / Case: 0603 (1608 Metric); Packaging: CutTape; PartId: 24637; Part Status: Active; Price: 0.01; Ratings: AEC-Q200; Series: CRCW; Size / Dimension: 0.061" L x 0.033" W (1.55mm x 0.85mm); Supplier 1: DigiKey; Supplier Part Number 1: 541-1.00KHCT-ND; Supplier Device Package: 0603; Tolerance: ±1%
R20 = CRCW06032K61FKEA: RES SMD 2.61K OHM 1% 1/10W 0603; Manufacturer: Vishay Dale; Power (Watts): 0.1W, 1/10W; Temperature Coefficient: ±100ppm/°C; Part Number: CRCW06032K61FKEA; Value: 2.61 kOhms; ComponentLink1Description: Datasheet; ComponentLink1URL: http://www.vishay.com/docs/20035/dcrcwe3.pdf; ComponentLink2Description: DigiKey Link; ComponentLink2URL: https://www.digikey.com/en/products/detail/vishay-dale/CRCW06032K61FKEA/1174713; Composition: Thick Film; Device Package: 0603 (1608 Metric); Features: Automotive AEC-Q200; Height - Seated (Max): 0.020" (0.50mm); LastUpdated: 9.02.2024 20:43:25; Lifecycle Status: Active; Minimum Order: 1; Number of Terminations: 2; Operating Temperature: -55°C ~ 155°C; Package / Case: 0603 (1608 Metric); Packaging: TapeAndReel; PartId: 7853; Part Status: Active; Price: 0.01; Ratings: AEC-Q200; Resistance: 2.61 kOhms; Series: CRCW; Size / Dimension: 0.061" L x 0.033" W (1.55mm x 0.85mm); Supplier 1: DigiKey; Supplier Part Number 1: 541-2.61KHCT-ND; Supplier Device Package: 0603; Tolerance: ±1%
R21 R29 = RNCP0603FTD24K9: RES 24.9K OHM 1% 1/8W 0603; Manufacturer: Stackpole Electronics Inc; Power (Watts): 0.125W, 1/8W; Temperature Coefficient: ±100ppm/°C; Part Number: RNCP0603FTD24K9; Value: 24.9 kΩ; ComponentLink1Description: Datasheet; ComponentLink1URL: https://www.seielect.com/catalog/sei-rncp.pdf; ComponentLink2Description: DigiKey Link; ComponentLink2URL: https://www.digikey.com/en/products/detail/stackpole-electronics-inc/RNCP0603FTD24K9/2240152; Composition: Thin Film; Device Package: 0603 (1608 Metric); Features: Anti-Sulfur; Height - Seated (Max): 0.022" (0.55mm); LastUpdated: 9.02.2024 20:43:33; Lifecycle Status: Active; Minimum Order: 1; Number of Terminations: 2; Operating Temperature: -55°C ~ 155°C; Package / Case: 0603 (1608 Metric); Packaging: TapeAndReel; PartId: 5725; Part Status: Active; Price: 0.01; Resistance: 24.9 kΩ; Series: RNCP; Size / Dimension: 0.061" L x 0.031" W (1.55mm x 0.80mm); Supplier 1: DigiKey; Supplier Part Number 1: RNCP0603FTD24K9CT-ND; Supplier Device Package: 0603; Tolerance: ±1%
R22 R26 R27 = RCS0603100KFKEA: RES SMD 100K OHM 1% 1/4W 0603; Manufacturer: Vishay Dale; Power (Watts): 0.25W, 1/4W; Temperature Coefficient: ±100ppm/°C; Part Number: RCS0603100KFKEA; Value: 100 kΩ; ComponentLink1Description: Datasheet; ComponentLink1URL: http://www.vishay.com/docs/20065/rcse3.pdf; ComponentLink2Description: DigiKey Link; ComponentLink2URL: https://www.digikey.com/en/products/detail/vishay-dale/RCS0603100KFKEA/5866946; Composition: Thick Film; Device Package: 0603 (1608 Metric); Features: Automotive AEC-Q200, Pulse Withstanding; Height - Seated (Max): 0.020" (0.50mm); LastUpdated: 9.02.2024 20:43:35; Lifecycle Status: Active; Minimum Order: 1; Number of Terminations: 2; Operating Temperature: -55°C ~ 155°C; Package / Case: 0603 (1608 Metric); Packaging: TapeAndReel; PartId: 5363; Part Status: Active; Price: 0.01; Ratings: AEC-Q200; Resistance: 100 kΩ; Series: RCS e3; Size / Dimension: 0.061" L x 0.033" W (1.55mm x 0.85mm); Supplier 1: DigiKey; Supplier Part Number 1: 541-2800-1-ND; Supplier Device Package: 0603; Tolerance: ±1%
R23 = RMCF0603FT69K8: RES 69.8K OHM 1% 1/10W 0603; Manufacturer: Stackpole Electronics Inc; Power (Watts): 0.1W, 1/10W; Temperature Coefficient: ±100ppm/°C; Part Number: RMCF0603FT69K8; Value: 69.8 kΩ; ComponentLink1Description: Datasheet; ComponentLink1URL: https://www.seielect.com/catalog/sei-rmcf_rmcp.pdf; ComponentLink2Description: DigiKey Link; ComponentLink2URL: https://www.digikey.com/en/products/detail/stackpole-electronics-inc/RMCF0603FT69K8/1714202; Composition: Thick Film; Device Package: 0603 (1608 Metric); Features: Automotive AEC-Q200; Height - Seated (Max): 0.022" (0.55mm); LastUpdated: 9.02.2024 20:42:51; Lifecycle Status: Active; Minimum Order: 1; Number of Terminations: 2; Operating Temperature: -55°C ~ 155°C; Package / Case: 0603 (1608 Metric); Packaging: CutTape; PartId: 16385; Part Status: Active; Price: 0.01; Ratings: AEC-Q200; Resistance: 69.8 kΩ; Series: RMCF; Size / Dimension: 0.061" L x 0.031" W (1.55mm x 0.80mm); Supplier 1: DigiKey; Supplier Part Number 1: RMCF0603FT69K8CT-ND; Supplier Device Package: 0603; Tolerance: ±1%
R24 = RC0603FR-074K64L: RES 4.64K OHM 1% 1/10W 0603; Manufacturer: Yageo; Power (Watts): 0.1W, 1/10W; Temperature Coefficient: ±100ppm/°C; Part Number: RC0603FR-074K64L; Value: 4.64 kΩ; ComponentLink1Description: Datasheet; ComponentLink1URL: https://www.yageo.com/upload/media/product/productsearch/datasheet/rchip/PYu-RC_Group_51_RoHS_L_10.pdf; ComponentLink2Description: DigiKey Link; ComponentLink2URL: https://www.digikey.com/en/products/detail/yageo/RC0603FR-074K64L/727211; Composition: Thick Film; Device Package: 0603 (1608 Metric); Features: Moisture Resistant; Height - Seated (Max): 0.022" (0.55mm); LastUpdated: 25.07.2024 09:19:27; Lifecycle Status: Active; Minimum Order: 1; Number of Terminations: 2; Operating Temperature: -55°C ~ 155°C; Package / Case: 0603 (1608 Metric); Packaging: CutTape; PartId: 12437; Part Status: Active; Price: 0.01; Resistance: 4.64 kΩ; Series: RC_L; Size / Dimension: 0.063" L x 0.031" W (1.60mm x 0.80mm); Supplier 1: DigiKey; Supplier Part Number 1: 311-4.64KHRCT-ND; Supplier Device Package: 0603; Tolerance: ±1%
R25 = RC0603FR-0740K2L: RES 40.2K OHM 1% 1/10W 0603; Manufacturer: Yageo; Power (Watts): 0.1W, 1/10W; Temperature Coefficient: ±100ppm/°C; Part Number: RC0603FR-0740K2L; Value: 40.2 kΩ; ComponentLink1Description: Datasheet; ComponentLink1URL: https://www.yageo.com/upload/media/product/productsearch/datasheet/rchip/PYu-RC_Group_51_RoHS_L_10.pdf; ComponentLink2Description: DigiKey Link; ComponentLink2URL: https://www.digikey.com/en/products/detail/yageo/RC0603FR-0740K2L/727221; Composition: Thick Film; Device Package: 0603 (1608 Metric); Features: Moisture Resistant; Height - Seated (Max): 0.022" (0.55mm); LastUpdated: 25.07.2024 09:19:28; Lifecycle Status: Active; Minimum Order: 1; Number of Terminations: 2; Operating Temperature: -55°C ~ 155°C; Package / Case: 0603 (1608 Metric); Packaging: CutTape; PartId: 12261; Part Status: Active; Price: 0.01; Resistance: 40.2 kΩ; Series: RC_L; Size / Dimension: 0.063" L x 0.031" W (1.60mm x 0.80mm); Supplier 1: DigiKey; Supplier Part Number 1: 311-40.2KHRCT-ND; Supplier Device Package: 0603; Tolerance: ±1%
R28 = RK73H1JTTD63R4F: RES 63.4 OHM 1% 1/8W 0603; Manufacturer: KOA Speer Electronics, Inc.; Power (Watts): 0.125W, 1/8W; Temperature Coefficient: ±100ppm/°C; Part Number: RK73H1JTTD63R4F; Value: 63.4 Ω; ComponentLink1Description: Datasheet; ComponentLink1URL: http://www.koaspeer.com/catimages/Products/RK73H/RK73H.pdf; ComponentLink2Description: DigiKey Link; ComponentLink2URL: https://www.digikey.com/en/products/detail/koa-speer-electronics-inc/RK73H1JTTD63R4F/9845379; Composition: Thick Film; Device Package: 0603 (1608 Metric); Features: Automotive AEC-Q200; Height - Seated (Max): 0.022" (0.55mm); LastUpdated: 25.07.2024 09:43:06; Lifecycle Status: Active; Minimum Order: 1; Number of Terminations: 2; Operating Temperature: -55°C ~ 155°C; Package / Case: 0603 (1608 Metric); Packaging: CutTape; PartId: 13917; Part Status: Active; Price: 0.01; Ratings: AEC-Q200; Resistance: 63.4 Ω; Series: RK73H; Size / Dimension: 0.063" L x 0.031" W (1.60mm x 0.80mm); Supplier 1: DigiKey; Supplier Part Number 1: 2019-RK73H1JTTD63R4FCT-ND; Supplier Device Package: 0603; Tolerance: ±1%
T1 = PA4065NL: Switching Transformer 1.58:1:1 0.075Ohm/0.41Ohm Prim. DCR 0.04Ohm Sec. DCR 10Term. Gull Wing SMD; Manufacturer_Name: PULSE; Geometry.Height: 12.32mm; Manufacturer_Part_Number: PA4065NL; Mouser Part Number: N/A; Mouser Price/Stock: https://www.mouser.com/Search/Refine.aspx?Keyword=N%2FA; Arrow Part Number: PA4065NL; Arrow Price/Stock: https://www.arrow.com/en/products/pa4065nl/pulse-electronics-corporation; Datasheet Link: https://www.mouser.de/datasheet/2/447/P675-2903965.pdf; Supplier 1: DigiKey; Supplier Part Number 1: PA4065NL-ND
U4 = HMHA2801A: Optoisolator Transistor Output 3750Vrms 1 Channel 4-Mini-Flat; Manufacturer_Name: onsemi; Geometry.Height: 2.39mm; Manufacturer_Part_Number: HMHA2801A; Mouser Part Number: 512-HMHA2801A; Mouser Price/Stock: https://www.mouser.co.uk/ProductDetail/onsemi-Fairchild/HMHA2801A?qs=kFka3UPfw%2Fr%2FqIBcKba8Jg%3D%3D; Arrow Part Number: HMHA2801A; Arrow Price/Stock: https://www.arrow.com/en/products/hmha2801a/on-semiconductor?utm_currency=USD&region=nac; Datasheet Link: https://www.digikey.ph/en/products/detail/onsemi/HMHA2801A/1052178; Supplier 1: DigiKey; Supplier Part Number 1: HMHA2801A-ND
U5 = CMP-0390-00071-2: High Power / High Efficiency PoE Interface and DC / DC Controller, -40 to 125 degC, 20-pin SOP (PW20), Green (RoHS & no Sb/Br); Manufacturer: Texas Instruments; Driven/Active Clamp (Second Gate Drive): Yes; rDS(on) per FET(Typ)(mOhms): 430; Duty Cycle(%): 78; Switching Frequency: Synchronizable and Programmable; SubFamily: Powered Device; PoE I/F & DC DC Control: TRUE; Auxiliary/Local Power Support: Programmable; UVLO: Unified; PoE Inrush Limit(Typ)(mA): 140; PD Power Level: 25W; Fault Response: Auto Retry; PoE Current Limit(Min)(mA): 850; Auxiliary Power Rails Supported: 24V-57V; PoE Standards Supported: 802.3at type1, 2; PackageVersion: 4073225-4/1; PackageDescription: 20-Pin PowerPAD Plastic Small Outline, Body 6.5 x 4.4 mm,0.65 mm Pitch; DatasheetVersion: SLVS885F; ComponentLink2Description: Datasheet; Eco-Plan: Green (RoHS & no Sb/Br); ComponentLink1Description: Manufacturer URL; ComponentLink2URL: http://www.ti.com/general/docs/lit/getliterature.tsp?genericPartNumber=TPS23754&fileType=pdf; Code_JEDEC: MO-153; Mounting Technology: Surface Mount; PackageReference: PWP0020D; ComponentLink3URL: http://www.ti.com/litv/pdf/mhts001g; ComponentLink3Description: Package Specification; PartNumber: TPS23754PWP; ComponentLink1URL: http://www.ti.com/
U6 = CMP-0366-00617-2: Adjustable Precision Shunt Regulator, 34 ppm / degC, 100 mA, -40 to 85 degC, 5-pin SOT-23 (DBV), Green (RoHS & no Sb/Br); Manufacturer: Texas Instruments; Initial Accuracy @ 25/deg C(%): 1; Iout/Iz(Max)(mA): 100; VO Adj(Max)(V): 36; Min Iz for Regulation(uA): 600; Rating: Catalog; Temp Coeff(Typ)(ppm/ degree C): 34; VO Adj(Min)(V): 2.495; SubFamily: Shunt Voltage Reference; Temp Coeff(Max)(ppm/ degree C): 92; Code_JEDEC: MO-178; PartNumber: TL431AIDBVT; Eco-Plan: Green (RoHS & no Sb/Br); ComponentLink2Description: Datasheet; PackageVersion: 4073253-4/K; PackageReference: DBV0005A; DatasheetVersion: SLVS543M; ComponentLink3Description: Package Specification; PackageDescription: 5-Pin Plastic Small Outline, Body 1.60 Ã— 2.90 mm, Pitch 0.95 mm; ComponentLink1URL: http://www.ti.com/; Mounting Technology: Surface Mount; ComponentLink1Description: Manufacturer URL; ComponentLink2URL: http://www.ti.com/general/docs/lit/getliterature.tsp?genericPartNumber=TL431A&fileType=pdf; ComponentLink3URL: http://www.ti.com/litv/pdf/mpds018i
U7 = PC357N4J000F: Transistor Output Optocouplers 300-600% CTR ranked PC357NJ0000F; Manufacturer_Name: Sharp Microelectronics; Geometry.Height: 3mm; Manufacturer_Part_Number: PC357N4J000F; Mouser Part Number: 852-PC357N4J000F; Mouser Price/Stock: https://www.mouser.co.uk/ProductDetail/Sharp-Microelectronics/PC357N4J000F?qs=UtH%252B%2FzslHwoprMr%2FFF3%252BjA%3D%3D; Arrow Part Number: PC357N4J000F; Arrow Price/Stock: https://www.arrow.com/en/products/pc357n4j000f/sharp?utm_currency=USD&region=europe; Datasheet Link: https://datasheet.datasheetarchive.com/originals/distributors/Datasheets_SAMA/8df7351162fb494e02ad9abf95b0d019.pdf; Supplier 1: DigiKey; Supplier Part Number 1: 1855-1022-1-ND